# Altium schematic sheet LTC6811-2 Circuit.SchDoc
size C
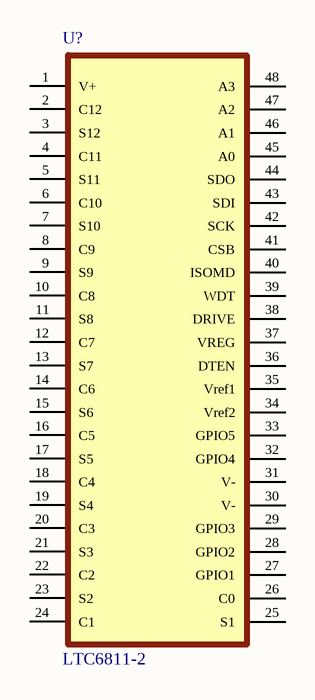
[diagram p0: LTC6811-2 Circuit.SchDoc]

## Parts
U?  LTC6811-2

## Nets

Not connected (* = marked no-connect by the designer): U? 1(V+) 2(C12) 3(S12) 4(C11) 5(S11) 6(C10) 7(S10) 8(C9) 9(S9) 10(C8) 11(S8) 12(C7) 13(S7) 14(C6) 15(S6) 16(C5) 17(S5) 18(C4) 19(S4) 20(C3) 21(S3) 22(C2) 23(S2) 24(C1) 25(S1) 26(C0) 27(GPIO1) 28(GPIO2) 29(GPIO3) 30(V-) 31(V-) 32(GPIO4) 33(GPIO5) 34(Vref2) 35(Vref1) 36(DTEN) 37(VREG) 38(DRIVE) 39(WDT) 40(ISOMD) 41(CSB) 42(SCK) 43(SDI) 44(SDO) 45(A0) 46(A1) 47(A2) 48(A3)

## Library data of the parts
U? = LTC6811-2: LTC6811-2, Multicell Battery Monitor, 48-Lead SSOP Package